# Altium schematic sheet ADC088S022.SchDoc
size A4; SheetNumber: 7; SheetTotal: 7
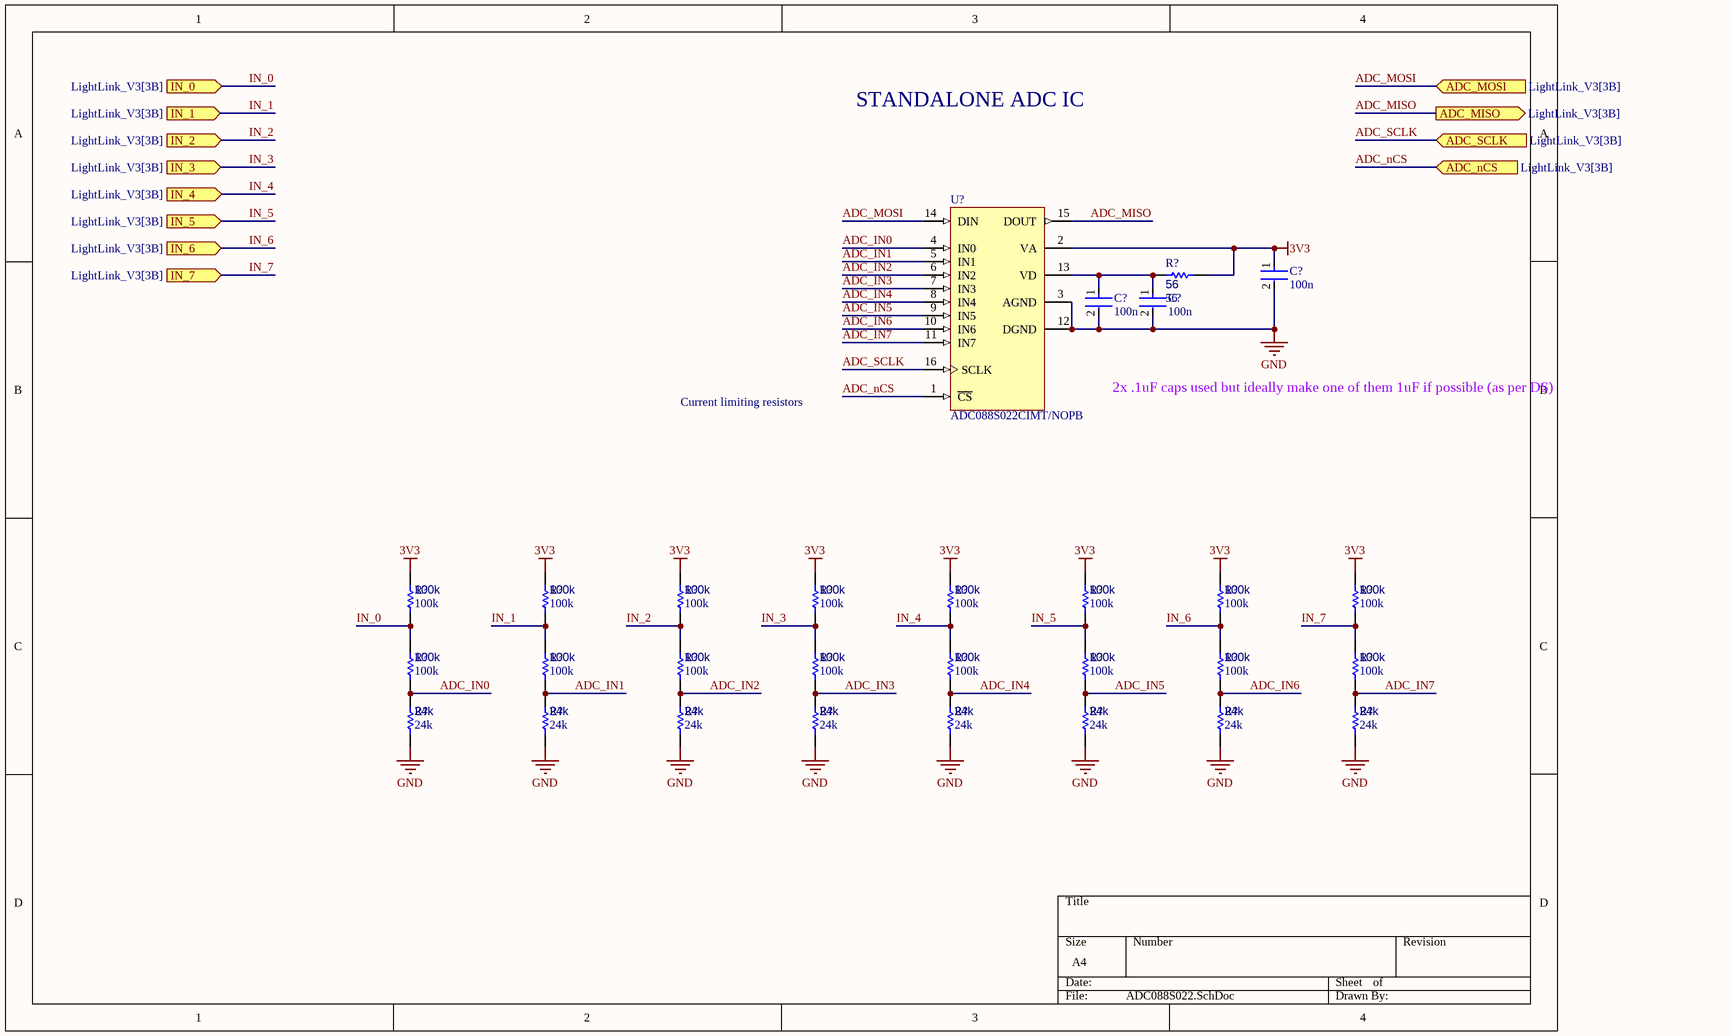
[diagram p0: ADC088S022.SchDoc]

## Parts
(Parts that share a designator on the sheet are numbered #1, #2 ... from top to bottom, then left to right.)
C?#1  100n  [FP-0402-L_1_0_0_05-W_0_5-IPC_A]
C?#2  100n  [FP-0402-L_1_0_0_05-W_0_5-IPC_A]
C?#3  100n  [FP-0402-L_1_0_0_05-W_0_5-IPC_A]
R?#1  56  [R0603B]
R?#2  100k  [R0603B]
R?#3  100k  [R0603B]
R?#4  100k  [R0603B]
R?#5  100k  [R0603B]
R?#6  100k  [R0603B]
R?#7  100k  [R0603B]
R?#8  100k  [R0603B]
R?#9  100k  [R0603B]
R?#10  100k  [R0603B]
R?#11  100k  [R0603B]
R?#12  100k  [R0603B]
R?#13  100k  [R0603B]
R?#14  100k  [R0603B]
R?#15  100k  [R0603B]
R?#16  100k  [R0603B]
R?#17  100k  [R0603B]
R?#18  24k  [R0603B]
R?#19  24k  [R0603B]
R?#20  24k  [R0603B]
R?#21  24k  [R0603B]
R?#22  24k  [R0603B]
R?#23  24k  [R0603B]
R?#24  24k  [R0603B]
R?#25  24k  [R0603B]
U?  ADC088S022CIMT/NOPB  [MTC16_L]

## Ports
ADC_MISO (out, see LightLink_V3[3B]), ADC_MOSI (in, see LightLink_V3[3B]), ADC_nCS (in, see LightLink_V3[3B]), ADC_SCLK (in, see LightLink_V3[3B]), IN_0 (in, see LightLink_V3[3B]), IN_1 (in, see LightLink_V3[3B]), IN_2 (in, see LightLink_V3[3B]), IN_3 (in, see LightLink_V3[3B]), IN_4 (in, see LightLink_V3[3B]), IN_5 (in, see LightLink_V3[3B]), IN_6 (in, see LightLink_V3[3B]), IN_7 (in, see LightLink_V3[3B])

## Nets
3V3: C?#1.1 R?#1.1 R?#2.2 R?#3.2 R?#4.2 R?#5.2 R?#6.2 R?#7.2 R?#8.2 R?#9.2 U?.2(VA)
GND: C?#1.2 C?#2.2 C?#3.2 R?#18.1 R?#19.1 R?#20.1 R?#21.1 R?#22.1 R?#23.1 R?#24.1 R?#25.1 U?.3(AGND) U?.12(DGND)
ADC_IN0: R?#10.1 R?#18.2 U?.4(IN0)
ADC_IN1: R?#11.1 R?#19.2 U?.5(IN1)
ADC_IN2: R?#12.1 R?#20.2 U?.6(IN2)
ADC_IN3: R?#13.1 R?#21.2 U?.7(IN3)
ADC_IN4: R?#14.1 R?#22.2 U?.8(IN4)
ADC_IN5: R?#15.1 R?#23.2 U?.9(IN5)
ADC_IN6: R?#16.1 R?#24.2 U?.10(IN6)
ADC_IN7: R?#17.1 R?#25.2 U?.11(IN7)
ADC_MISO: U?.15(DOUT) ; port ADC_MISO
ADC_MOSI: U?.14(DIN) ; port ADC_MOSI
ADC_nCS: U?.1(~{CS}) ; port ADC_nCS
ADC_SCLK: U?.16(SCLK) ; port ADC_SCLK
IN_0: R?#2.1 R?#10.2 ; port IN_0
IN_1: R?#3.1 R?#11.2 ; port IN_1
IN_2: R?#4.1 R?#12.2 ; port IN_2
IN_3: R?#5.1 R?#13.2 ; port IN_3
IN_4: R?#6.1 R?#14.2 ; port IN_4
IN_5: R?#7.1 R?#15.2 ; port IN_5
IN_6: R?#8.1 R?#16.2 ; port IN_6
IN_7: R?#9.1 R?#17.2 ; port IN_7
NetC?#2_1: C?#2.1 C?#3.1 R?#1.2 U?.13(VD)

## Notes on the sheet
- STANDALONE ADC IC
- Current limiting resistors
- 2x .1uF caps used but ideally make one of them 1uF if possible (as per DS)

## Library data of the parts
C?#1-C?#3 = CMP-001-00058-1: LARGE PADS, 0402 CAP, CHANGE COMMENT TO MATCH REAL P/N; Capacitor Type: Ceramic; Min Operating Temperature: -55°C; Mounting Technology: Surface Mount; Pins: 2; Case/Package: 0402; RoHS Compliant: Yes; Max Operating Temperature: 85°C
R?#1-R?#25 = CMP-009-00002-14: Resistor
  R?#1: Value: 56
  R?#2-R?#17: Value: 100k
  R?#18-R?#25: Value: 24k
U? = CMP-0054-00372-2: 8-Channel, 50 kSPS to 200 kSPS, 8-Bit A/D Converter, 16-pin TSSOP, Pb-Free; Manufacturer: National Semiconductor; PackageTopMarking: NSUZXYTT*88S022*CIMT; CompType: ADC IC; PowerWise: Y; ComponentLink2URL: http://www.national.com/pf/AD/ADC088S022.html; RoHS: Y; PackageDescription: Molded TSSOP, Jedec, 5 x 4.4 x 0.9mm Body, 16 Lead, 0.65mm Pitch; DatasheetVersion: Feb-2010; PinCount: 16; ComponentLink1Description: ADC088S022 Datasheet; Code_JEDEC: MO-153-AB; ComponentLink3URL: http://www.national.com/packaging/folders/mtc16.html; PackageVersion: revD, Jun-2003; ComponentLink3Description: MTC16 Package Page; RevisionNote: Component URLs added; ComponentLink1URL: http://www.national.com/ds/AD/ADC088S022.pdf; ComponentLink2Description: ADC088S022 Web Page; PackageReference: MTC16